# EAGLE design LMD18200_2_7_5 (EAGLE 7.7.0)
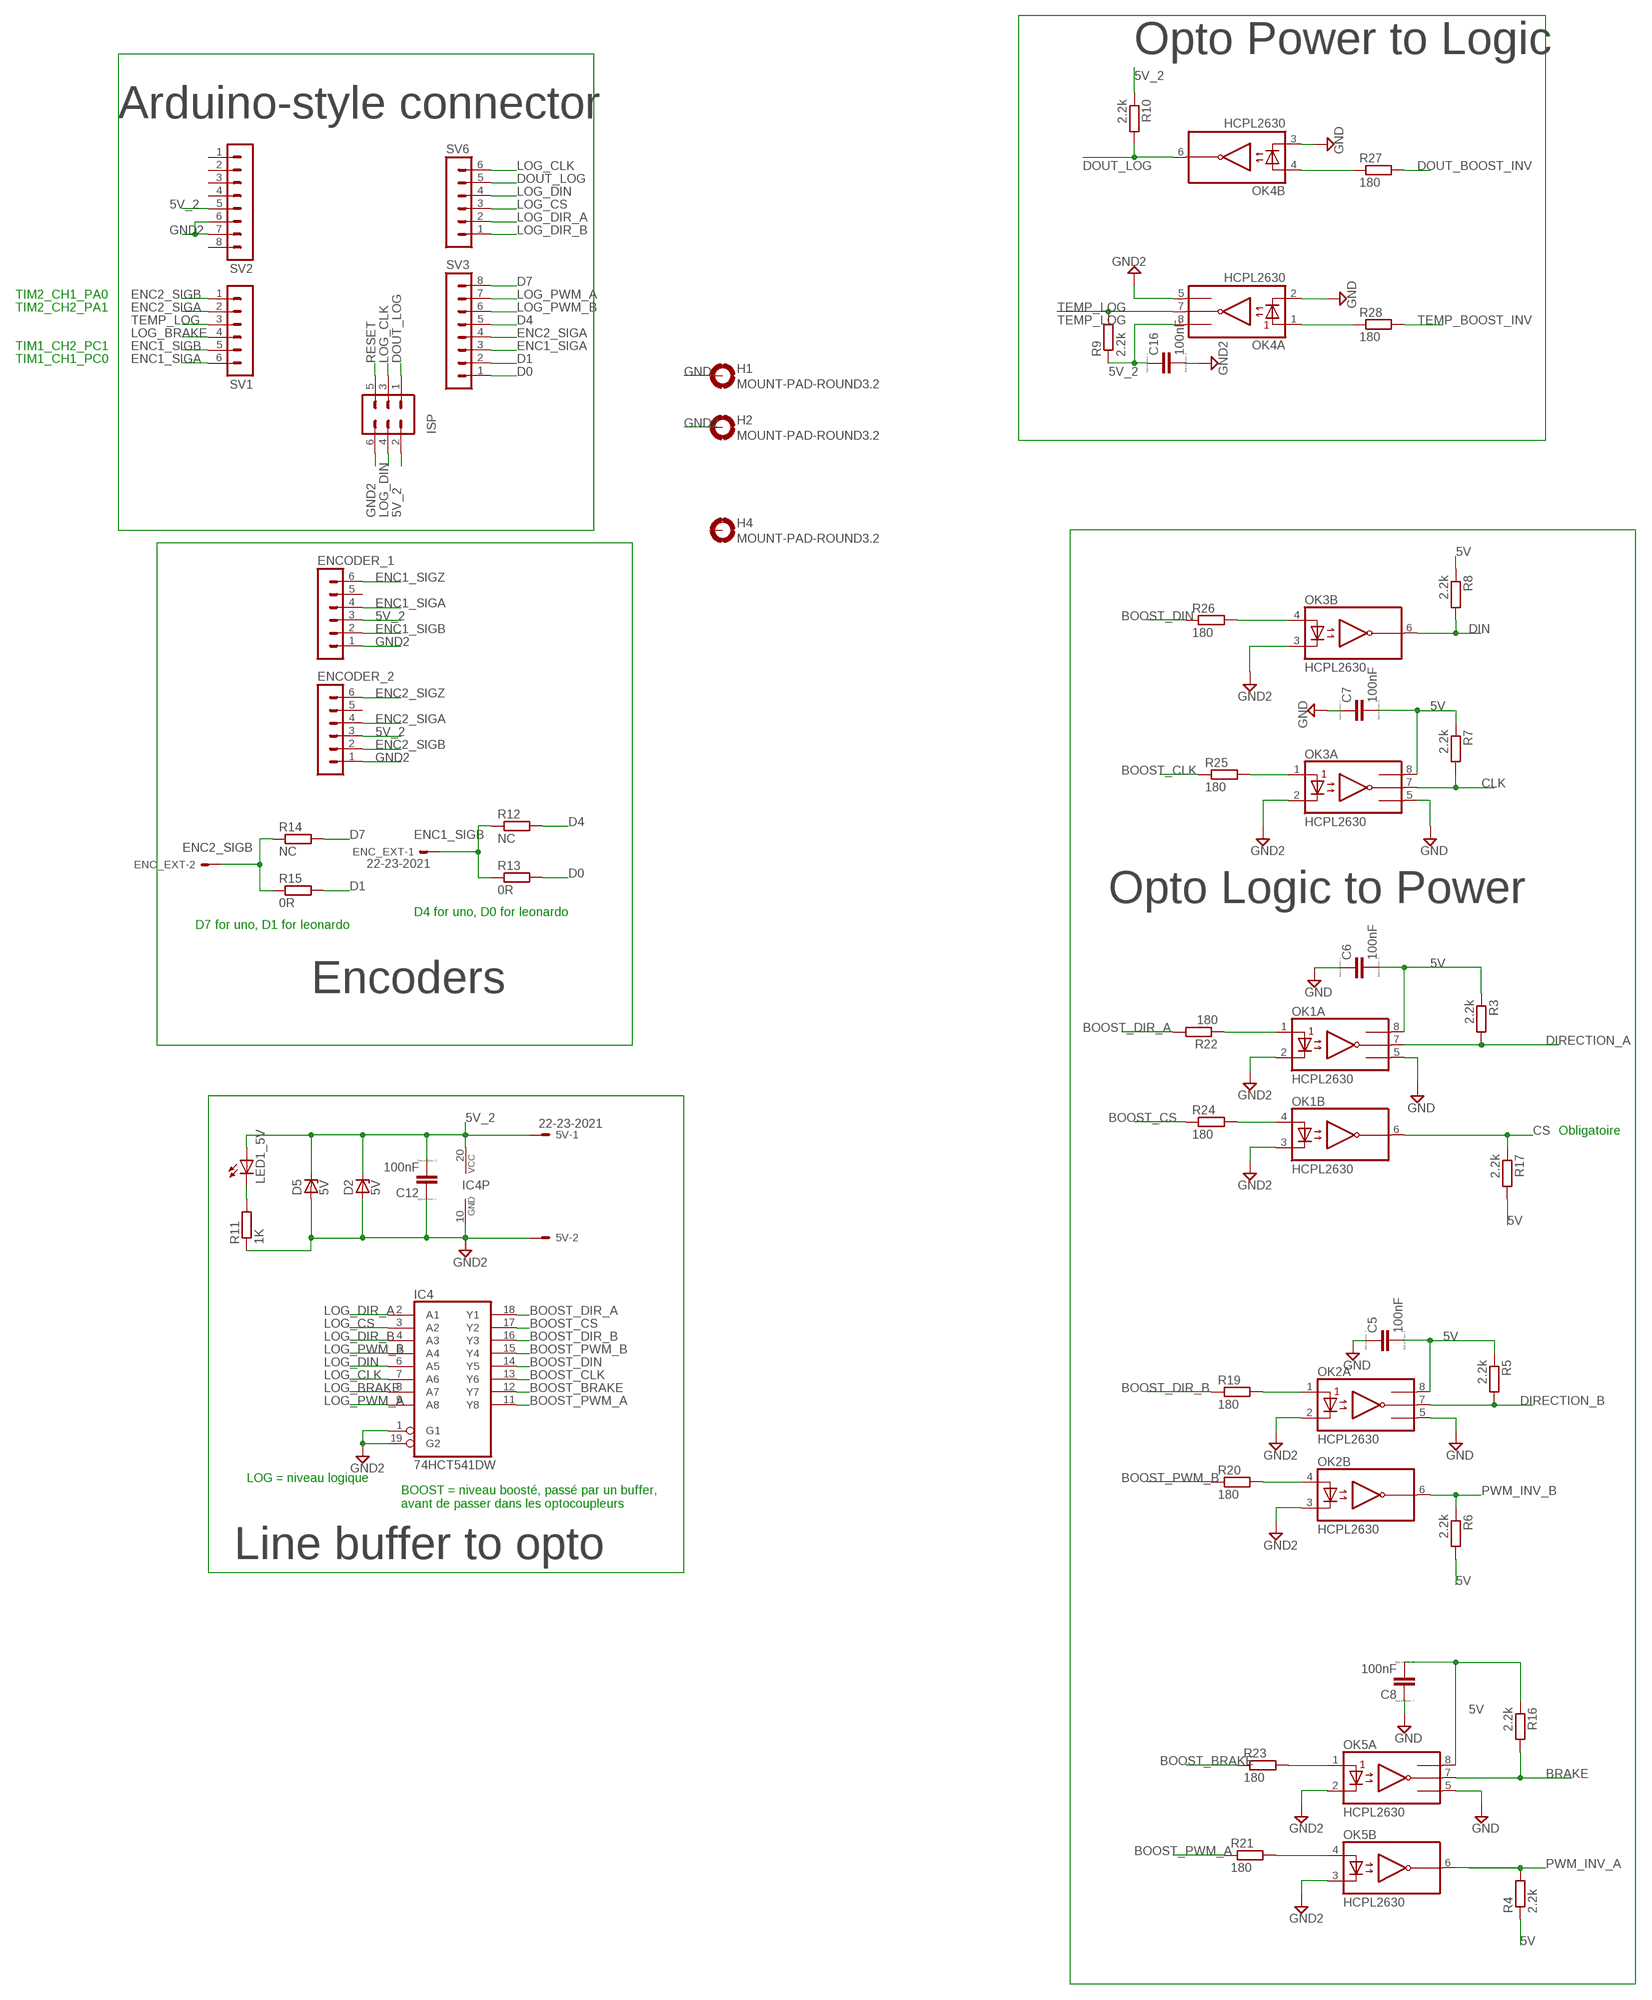
[diagram p0: schematic, sheet 1, part 1 of 2]
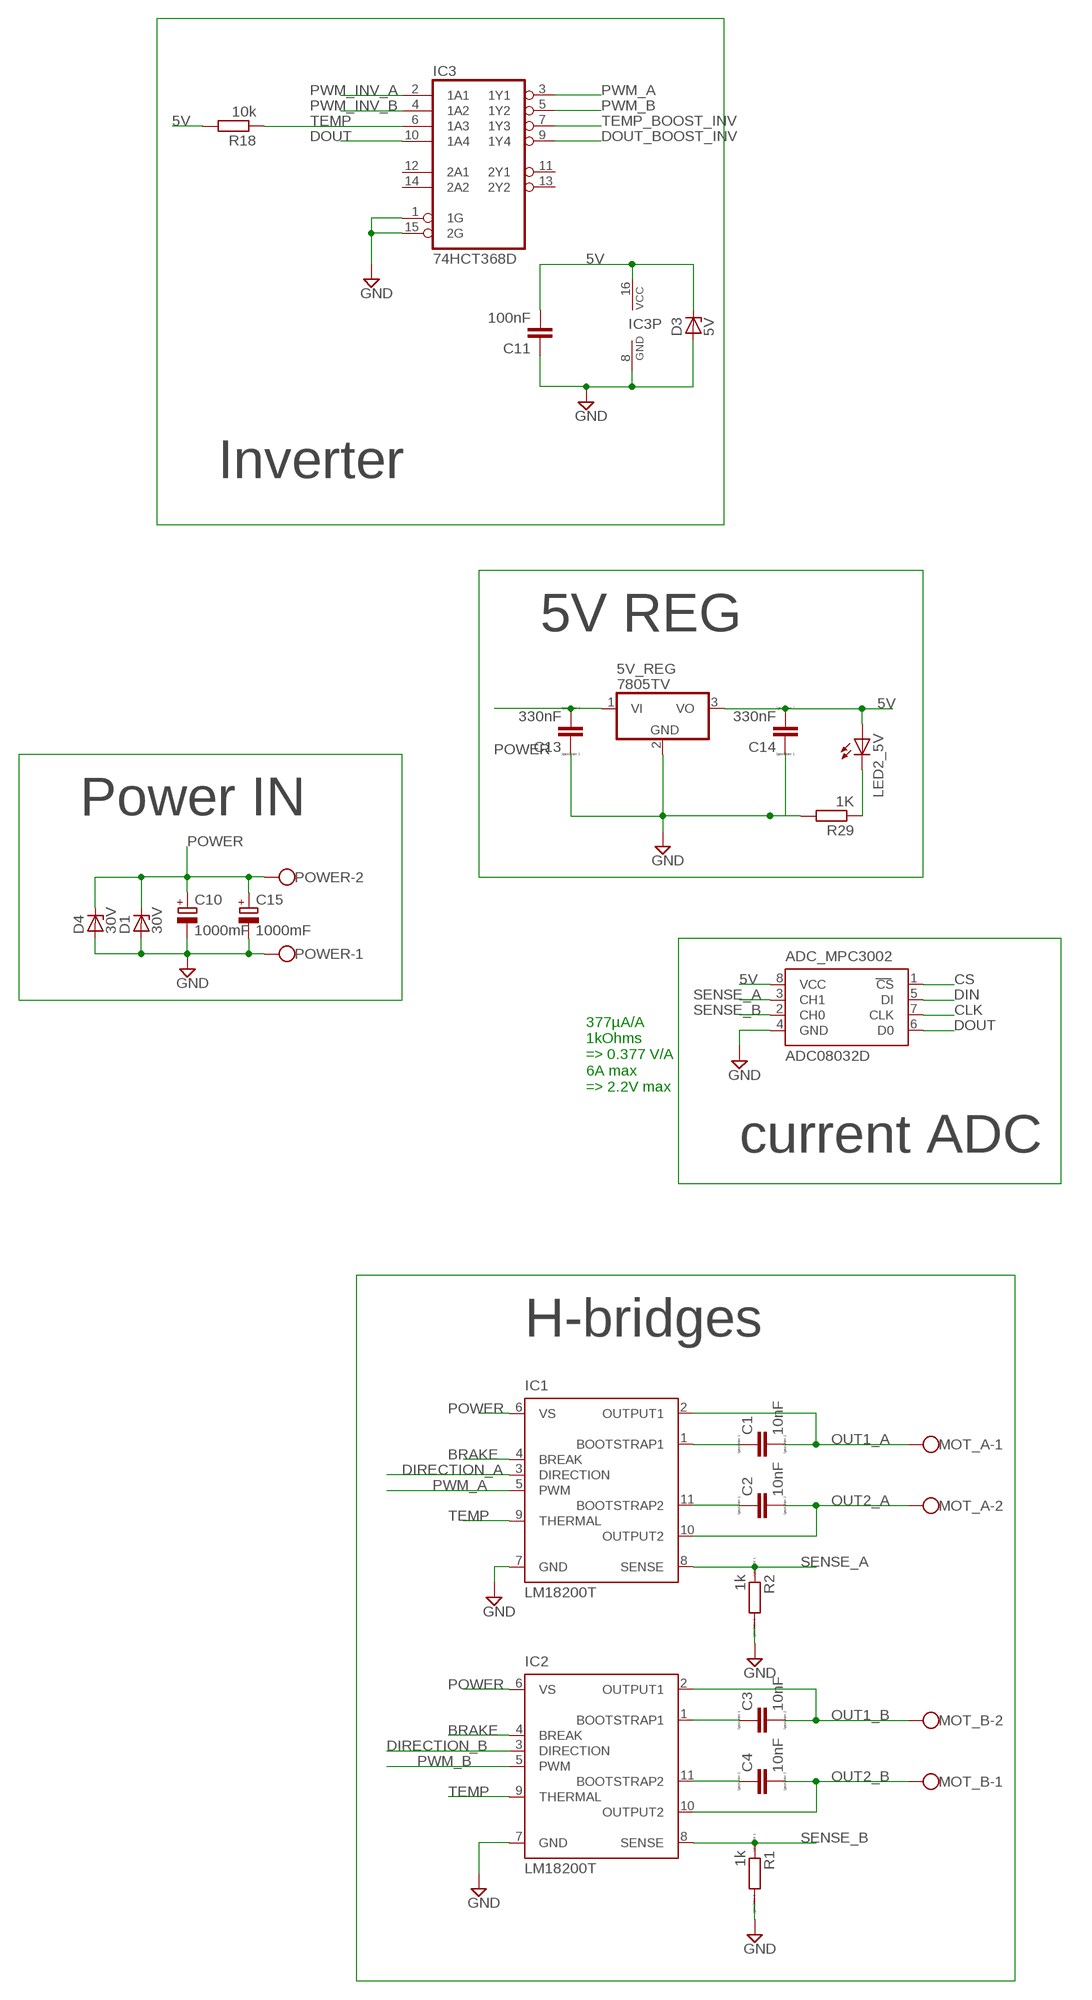
[diagram p1: schematic, sheet 1, part 2 of 2]

## Parts
5V  22-23-2021  [22-23-2021]
5V_REG  7805TV  [TO220V]
ADC_MPC3002  ADC08032D  [SO08]
C1  10nF  CC0603  [C0603]
C2  10nF  CC0603  [C0603]
C3  10nF  CC0603  [C0603]
C4  10nF  CC0603  [C0603]
C5  100nF  CC0603  [C0603]
C6  100nF  CC0603  [C0603]
C7  100nF  CC0603  [C0603]
C8  100nF  CC0603  [C0603]
C10  1000mF  CPOL-EUE5-13  [E5-13]
C11  100nF  C-EUC0805  [C0805]
C12  100nF  CC0603  [C0603]
C13  330nF  CC0603  [C0603]
C14  330nF  CC0603  [C0603]
C15  1000mF  CPOL-EUE5-13  [E5-13]
C16  100nF  CC0603  [C0603]
D1  30V  ZENER-DIODESOD80C  [SOD80C]
D2  5V  ZENER-DIODESOD80C  [SOD80C]
D3  5V  ZENER-DIODEDO34-7  [DO34Z7]
D4  30V  ZENER-DIODEDO34-7  [DO34Z7]
D5  5V  ZENER-DIODEDO34-7  [DO34Z7]
ENC_EXT  22-23-2021  [22-23-2021]
ENCODER_1  MA06-1  [MA06-1]
ENCODER_2  MA06-1  [MA06-1]
H1  MOUNT-PAD-ROUND3.2  [3,2-PAD]
H2  MOUNT-PAD-ROUND3.2  [3,2-PAD]
H4  MOUNT-PAD-ROUND3.2  [3,2-PAD]
IC1  LM18200T  [TO-220-11]
IC2  LM18200T  [TO-220-11]
IC3  74HCT368D  [SO16]
IC4  74HCT541DW  [SO20W]
ISP  MA03-2  [MA03-2]
LED1_5V  LEDSML0805  [SML0805]
LED2_5V  LEDSML0805  [SML0805]
MOT_A  W237-102  [W237-102]
MOT_B  W237-102  [W237-102]
OK1  HCPL2630  [DIL08]
OK2  HCPL2630  [DIL08]
OK3  HCPL2630  [DIL08]
OK4  HCPL2630  [DIL08]
OK5  HCPL2630  [DIL08]
POWER  W237-102  [W237-102]
R1  1k  RR0603  [R0603]
R2  1k  RR0603  [R0603]
R3  2.2k  R-EU_R0603  [R0603]
R4  2.2k  R-EU_R0603  [R0603]
R5  2.2k  R-EU_R0603  [R0603]
R6  2.2k  R-EU_R0603  [R0603]
R7  2.2k  R-EU_R0603  [R0603]
R8  2.2k  R-EU_R0603  [R0603]
R9  2.2k  R-EU_R0603  [R0603]
R10  2.2k  R-EU_R0603  [R0603]
R11  1K  R-EU_R0603  [R0603]
R12  NC  R-EU_R0603  [R0603]
R13  0R  R-EU_R0603  [R0603]
R14  NC  R-EU_R0603  [R0603]
R15  0R  R-EU_R0603  [R0603]
R16  2.2k  R-EU_R0603  [R0603]
R17  2.2k  R-EU_R0603  [R0603]
R18  10k  R-EU_R0603  [R0603]
R19  180  R-EU_R0603  [R0603]
R20  180  R-EU_R0603  [R0603]
R21  180  R-EU_R0603  [R0603]
R22  180  R-EU_R0603  [R0603]
R23  180  R-EU_R0603  [R0603]
R24  180  R-EU_R0603  [R0603]
R25  180  R-EU_R0603  [R0603]
R26  180  R-EU_R0603  [R0603]
R27  180  R-EU_R0603  [R0603]
R28  180  R-EU_R0603  [R0603]
R29  1K  R-EU_R0603  [R0603]
SV1  MA06-1  [MA06-1]
SV2  MA08-1  [MA08-1]
SV3  MA08-1  [MA08-1]
SV6  MA06-1  [MA06-1]

## Nets
5V: 5V_REG.3(VO) ADC_MPC3002.8(VCC) C5.2 C6.2 C7.2 C8.2 C11.2 C14.2 D3.C IC3.16(VCC) LED2_5V.A OK1.8(A:VCC) OK2.8(A:VCC) OK3.8(A:VCC) OK5.8(A:VCC) R3.1 R4.1 R5.1 R6.2 R7.1 R8.1 R16.1 R17.2 R18.2
5V_2: 5V.1 C12.2 C16.1 D2.C D5.C ENCODER_1.3 ENCODER_2.3 IC4.20(VCC) ISP.2 LED1_5V.A OK4.8(A:VCC) R9.1 R10.1 SV2.5
BOOST_BRAKE: IC4.12(Y7) R23.1
BOOST_CLK: IC4.13(Y6) R25.1
BOOST_CS: IC4.17(Y2) R24.1
BOOST_DIN: IC4.14(Y5) R26.1
BOOST_DIR_A: IC4.18(Y1) R22.2
BOOST_DIR_B: IC4.16(Y3) R19.1
BOOST_OUT1_A: C1.1 IC1.1(BOOTSTRAP1)
BOOST_OUT1_B: C3.1 IC2.1(BOOTSTRAP1)
BOOST_OUT2_A: C2.1 IC1.11(BOOTSTRAP2)
BOOST_OUT2_B: C4.1 IC2.11(BOOTSTRAP2)
BOOST_PWM_A: IC4.11(Y8) R21.1
BOOST_PWM_B: IC4.15(Y4) R20.1
BRAKE: IC1.4(BREAK) IC2.4(BREAK) OK5.7(A:VO1) R16.2
CLK: ADC_MPC3002.7(CLK) OK3.7(A:VO1) R7.2
CS: ADC_MPC3002.1(CS) OK1.6(B:VO2) R17.1
D0: R13.2 SV3.1
D1: R15.2 SV3.2
D4: R12.2 SV3.5
D7: R14.2 SV3.8
DIN: ADC_MPC3002.5(DI) OK3.6(B:VO2) R8.2
DIRECTION_A: IC1.3(DIRECTION) OK1.7(A:VO1) R3.2
DIRECTION_B: IC2.3(DIRECTION) OK2.7(A:VO1) R5.2
DOUT: ADC_MPC3002.6(D0) IC3.10(1A4)
DOUT_BOOST_INV: IC3.9(1Y4) R27.2
DOUT_LOG: ISP.1 OK4.6(B:VO2) R10.2 SV6.5
ENC1_SIGA: ENCODER_1.4 SV1.6 SV3.3
ENC1_SIGB: ENC_EXT.1 ENCODER_1.2 R12.1 R13.1 SV1.5
ENC1_SIGZ: ENCODER_1.6
ENC2_SIGA: ENCODER_2.4 SV1.2 SV3.4
ENC2_SIGB: ENC_EXT.2 ENCODER_2.2 R14.1 R15.1 SV1.1
ENC2_SIGZ: ENCODER_2.6
GND: 5V_REG.2(GND) ADC_MPC3002.4(GND) C5.1 C6.1 C7.1 C8.1 C10.- C11.1 C13.1 C14.1 C15.- D1.A D3.A D4.A H1.B3,2(MOUNT) IC1.7(GND) IC2.7(GND) IC3.1(1G) IC3.8(GND) IC3.15(2G) OK1.5(A:GND) OK2.5(A:GND) OK3.5(A:GND) OK4.2(A:C1) OK4.3(B:C2) OK5.5(A:GND) POWER.1 R1.2 R2.2 R29.2
GND2: 5V.2 C12.1 C16.2 D2.A D5.A ENCODER_1.1 ENCODER_2.1 H2.B3,2(MOUNT) IC4.1(G1) IC4.10(GND) IC4.19(G2) ISP.6 OK1.2(A:C1) OK1.3(B:C2) OK2.2(A:C1) OK2.3(B:C2) OK3.2(A:C1) OK3.3(B:C2) OK4.5(A:GND) OK5.2(A:C1) OK5.3(B:C2) R11.1 SV2.6 SV2.7
LED1_SIG: LED1_5V.C R11.2
LED2_5V_SIG: LED2_5V.C R29.1
LOG_BRAKE: IC4.8(A7) SV1.4
LOG_CLK: IC4.7(A6) ISP.3 SV6.6
LOG_CS: IC4.3(A2) SV6.3
LOG_DIN: IC4.6(A5) ISP.4 SV6.4
LOG_DIR_A: IC4.2(A1) SV6.2
LOG_DIR_B: IC4.4(A3) SV6.1
LOG_PWM_A: IC4.9(A8) SV3.7
LOG_PWM_B: IC4.5(A4) SV3.6
OUT1_A: C1.2 IC1.2(OUTPUT1) MOT_A.1
OUT1_B: C3.2 IC2.2(OUTPUT1) MOT_B.2
OUT2_A: C2.2 IC1.10(OUTPUT2) MOT_A.2
OUT2_B: C4.2 IC2.10(OUTPUT2) MOT_B.1
POWER: 5V_REG.1(VI) C10.+ C13.2 C15.+ D1.C D4.C IC1.6(VS) IC2.6(VS) POWER.2
PWM_A: IC1.5(PWM) IC3.3(1Y1)
PWM_B: IC2.5(PWM) IC3.5(1Y2)
PWM_INV_A: IC3.2(1A1) OK5.6(B:VO2) R4.2
PWM_INV_B: IC3.4(1A2) OK2.6(B:VO2) R6.1
R_BOOST_BRAKE: OK5.1(A:A1) R23.2
R_BOOST_CLK: OK3.1(A:A1) R25.2
R_BOOST_CS: OK1.4(B:A2) R24.2
R_BOOST_DIN: OK3.4(B:A2) R26.2
R_BOOST_DIR_A: OK1.1(A:A1) R22.1
R_BOOST_DIR_B: OK2.1(A:A1) R19.2
R_BOOST_PWM_A: OK5.4(B:A2) R21.2
R_BOOST_PWM_B: OK2.4(B:A2) R20.2
R_DOUT_BOOST_INV: OK4.4(B:A2) R27.1
R_TEMP_BOOST_INV: OK4.1(A:A1) R28.1
RESET: ISP.5
SENSE_A: ADC_MPC3002.3(CH1) IC1.8(SENSE) R2.1
SENSE_B: ADC_MPC3002.2(CH0) IC2.8(SENSE) R1.1
TEMP: IC1.9(THERMAL) IC2.9(THERMAL) IC3.6(1A3) R18.1
TEMP_BOOST_INV: IC3.7(1Y3) R28.2
TEMP_LOG: OK4.7(A:VO1) R9.2 SV1.3
Unconnected: ENCODER_1.5 ENCODER_2.5 H4.B3,2(MOUNT) IC3.11(2Y1) IC3.12(2A1) IC3.13(2Y2) IC3.14(2A2) SV2.1 SV2.2 SV2.3 SV2.4 SV2.8

## Notes on the sheet
- Opto Power to Logic
- Arduino-style connector
- TIM2_CH1_PA0
- TIM2_CH2_PA1
- TIM1_CH2_PC1
- TIM1_CH1_PC0
- Inverter
- 5V REG
- Power IN
- Opto Logic to Power
- D4 for uno, D0 for leonardo
- D7 for uno, D1 for leonardo
- Encoders
- 377µA/A
  1kOhms
  => 0.377 V/A
  6A max
  => 2.2V max
- current ADC
- Obligatoire
- H-bridges
- LOG = niveau logique
- BOOST = niveau boosté, passé par un buffer, 
  avant de passer dans les optocoupleurs
- Line buffer to opto

## Library data of the parts
5V ENC_EXT = con-molex:22-23-2021: .100" (2.54mm) Center Header - 2 Pin; MF: MOLEX; MPN: 22-23-2021; OC_FARNELL: 1462926; OC_NEWARK: 25C3832
5V_REG = linear:78*: Positive VOLTAGE REGULATOR Source: http://cache.national.com/ds/LM/LM78L05.pdf http://www.fairchildsemi.com/ds/LM/LM7805.pdf
ADC_MPC3002 = linear:ADC08032: A/D CONVERTER
C1-C8 C12-C14 C16 = eagle-ltspice:C: CAPACITOR, European symbol; SPICEMODEL: NONE; SPICEPREFIX: C
C10 C15 = resistor:CPOL-EU: POLARIZED CAPACITOR, European symbol
C11 = resistor:C-EU: CAPACITOR, European symbol
D1-D5 = diode:ZENER-DIODE: Z-Diode
ENCODER_1 ENCODER_2 SV1 SV6 = con-lstb:MA06-1: PIN HEADER; OC_FARNELL: unknown; OC_NEWARK: unknown
H1 H2 H4 = holes:MOUNT-PAD-ROUND: MOUNTING PAD, round
IC1 IC2 = national-semiconductor:LM18200T: 3A, 55V H-Bridge Motor Control SourcE: http://cache.national.com/ds/LM/LMD18200.pdf; OC_FARNELL: unknown; OC_NEWARK: unknown
IC3 = 74xx-eu:74*368: Hex BUS DRIVER, 3-state
IC4 = 74xx-eu:74*541: Octal BUFFER and LINE DRIVER, 3-state
ISP = con-lstb:MA03-2: PIN HEADER; OC_FARNELL: unknown; OC_NEWARK: unknown
LED1_5V LED2_5V = led:LED: LED OSRAM: - CHIPLED LG R971, LG N971, LY N971, LG Q971, LY Q971, LO R971, LY R971 LH N974, LH R974 LS Q976, LO Q976, LY Q976 LO Q996 - Hyper CHIPLED LW Q18S LB Q993, LB Q99A, LB R99A - SideLED LS A670, LO A670, LY A670, LG A670, LP A670 LB A673, LV A673, LT A673, LW A673 LH A674 LY A675 LS A676, LA A676, LO A676, LY A676, LW A676 LS A679, LY A679, LG A679 - Hyper Micro SIDELED® LS Y876, LA Y876, LO Y876, LY Y876 LT Y87S - SmartLED LW L88C, LW L88S LB L89C, LB L89S, LG L890 LS L89K, LO L89K, LY L89K LS L896, LA L896, LO L896, LY L896 - TOPLED LS T670, LO T670, LY T670, LG T670, LP T670 LSG T670, LSP T670, LSY T670, LOP T670, LYG T670 LG T671, LOG T671, LSG T671 LB T673, LV T673, LT T673, LW T673 LH T674 LS T676, LA T676, LO T676, LY T676, LB T676, LH T676, LSB T676, LW T676 LB T67C, LV T67C, LT T67C, LS T67K, LO T67K, LY T67K, LW E67C LS E67B, LA E67B, LO E67B, LY E67B, LB E67C, LV E67C, LT E67C LW T67C LS T679, LY T679, LG T679 LS T770, LO T770, LY T770, LG T770, LP T770 LB T773, LV T773, LT T773, LW T773 LH T774 LS E675, LA E675, LY E675, LS T675 LS T776, LA T776, LO T776, LY T776, LB T776 LHGB T686 LT T68C, LB T68C - Hyper Mini TOPLED® LB M676 - Mini TOPLED Santana® LG M470 LS M47K, LO M47K, LY M47K Source: http://www.osram.convergy.de LUXEON: - LUMILED® LXK2-PW12-R00, LXK2-PW12-S00, LXK2-PW14-U00, LXK2-PW14-V00 LXK2-PM12-R00, LXK2-PM12-S00, LXK2-PM14-U00 LXK2-PE12-Q00, LXK2-PE12-R00, LXK2-PE12-S00, LXK2-PE14-T00, LXK2-PE14-U00 LXK2-PB12-K00, LXK2-PB12-L00, LXK2-PB12-M00, LXK2-PB14-N00, LXK2-PB14-P00, LXK2-PB14-Q00 LXK2-PR12-L00, LXK2-PR12-M00, LXK2-PR14-Q00, LXK2-PR14-R00 LXK2-PD12-Q00, LXK2-PD12-R00, LXK2-PD12-S00 LXK2-PH12-R00, LXK2-PH12-S00 LXK2-PL12-P00, LXK2-PL12-Q00, LXK2-PL12-R00 Source: www.luxeon.com KINGBRIGHT: KA-3528ASYC Source: www.kingbright.com
MOT_A MOT_B POWER = con-wago-500:W237-102: WAGO SCREW CLAMP; MPN: 237-102; OC_FARNELL: unknown; OC_NEWARK: 70K9898
OK1-OK5 = optocoupler:HCPL2630: HEWLETT PACKARD OPTO COUPLER; MF: AGILENT TECHNOLOGIES; MPN: HCPL-2630-000E; OC_FARNELL: 9994904; OC_NEWARK: 88H7813
R1 R2 = eagle-ltspice:R: RESISTOR, European symbol; SPICEMODEL: NONE; SPICEPREFIX: R
R3-R29 = rcl:R-EU_: RESISTOR, European symbol
SV2 SV3 = con-lstb:MA08-1: PIN HEADER; OC_FARNELL: unknown; OC_NEWARK: unknown

## Board
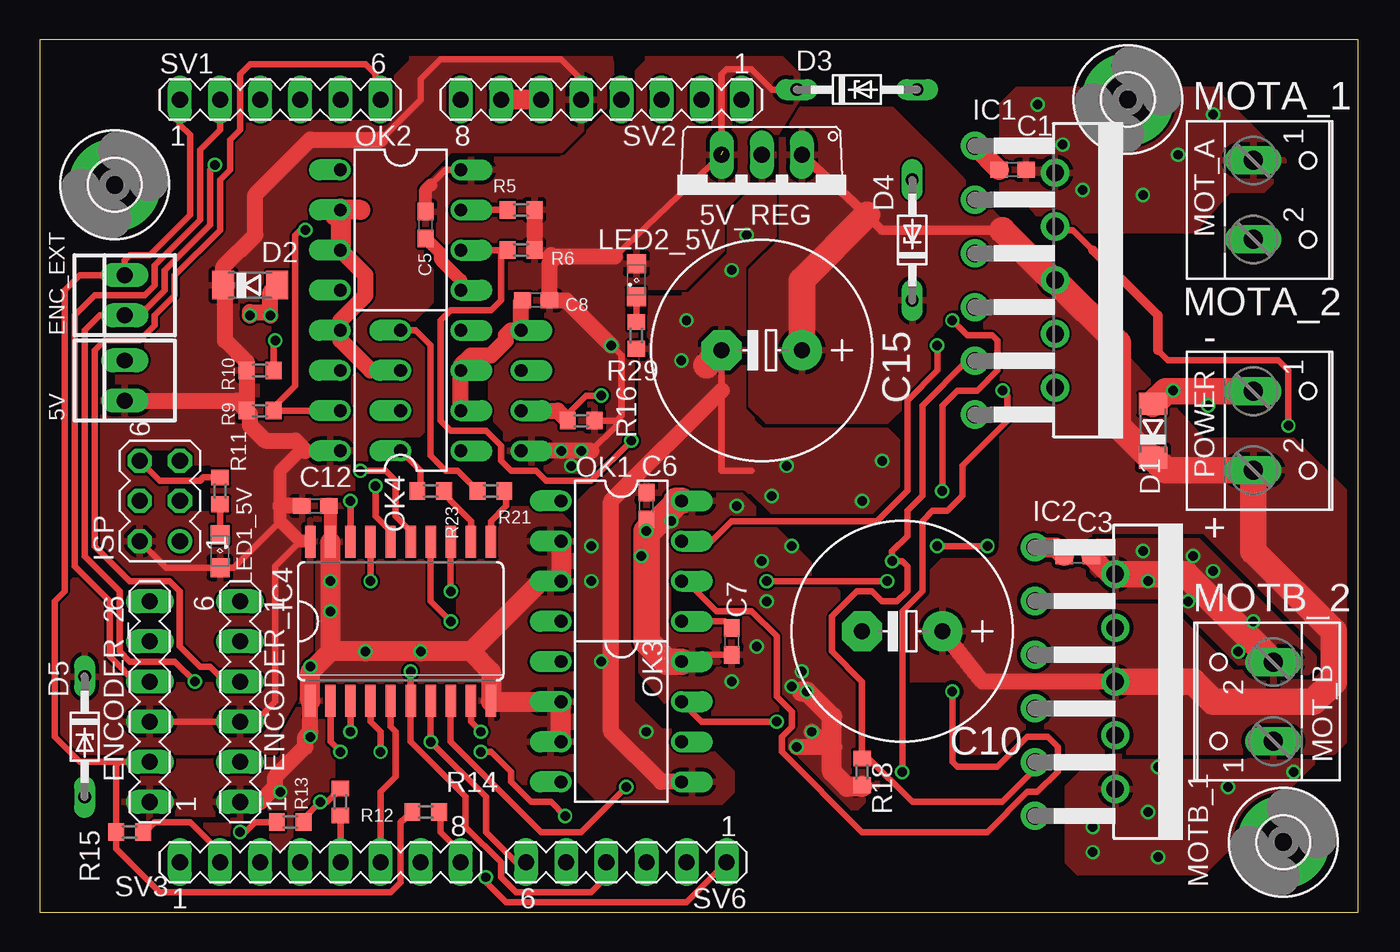
[diagram p2: board, top side]
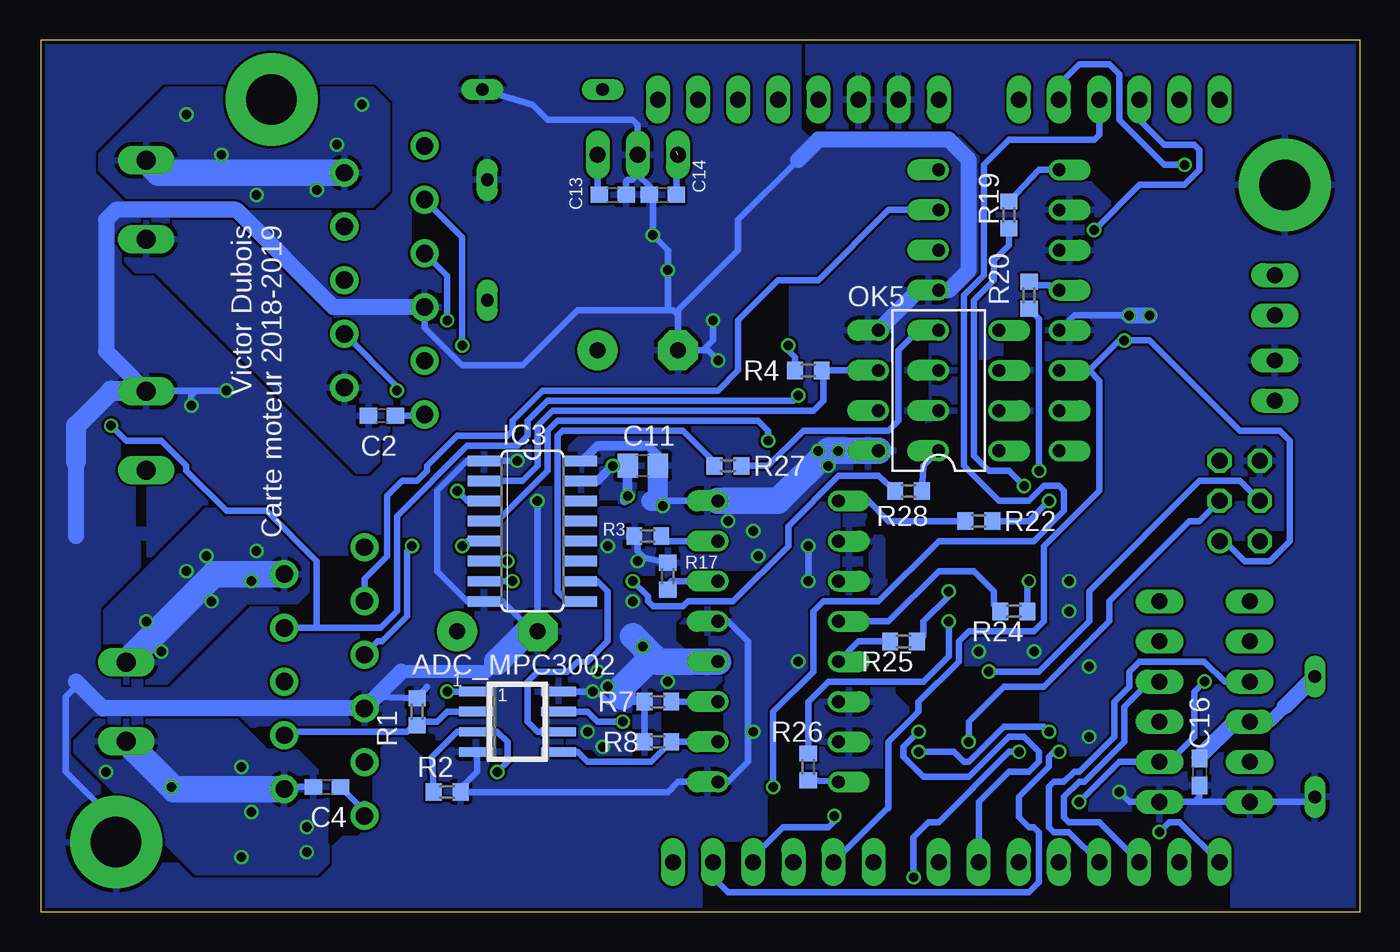
[diagram p3: board, bottom side, seen from below]

Size 83.49 x 55.23 mm. Coordinates in mm from the lower left corner, seen from the top.
Outline: 0,0 83.49,0 83.49,55.23 0,55.23 0,0
Copper layers (1*16): Top 0.035mm / dielectric 1.5mm / Bottom 0.035mm
Design rules "SeeedStudio_2layer_DRU_no_angle_20140221": minimum track width 6mil, minimum drill 12mil, track to track 6mil, track to pad 6mil, pad to pad 6mil, via to via 6mil, smd to smd 0mil, copper to edge 10mil, drill to drill 10mil, minimum pad ring 10mil, minimum via ring 6mil, stop-mask expansion 2mil, vias tented up to drill 100mil, thermal gap 10mil
tRestrict: area 23.2,36.8 to 25.1,38.4; area 23.2,29.2 to 24.8,30.5; area 20,26.4 to 20.3,27.3; area 10.2,14.6 to 11.1,14.9; area 8.3,14.6 to 9.2,14.9; area 4.4,32.7 to 4.8,34.3; area 19.1,32.1 to 19.7,34; area 48.9,21.3 to 49.2,22.5; area 45.4,25.1 to 45.7,25.7; area 40,18.7 to 40.3,20.6; area 14,32.1 to 14.3,33.7; area 14.3,50.2 to 21,50.5; 13 more areas
bRestrict: area 44.5,26 to 45.1,28.9; area 20.6,21.3 to 21.3,23.2; area 5.7,10.2 to 6,11.4; area 21.9,29.5 to 22.5,36.2; area 28.3,13 to 29.2,14.3; area 30.2,8.3 to 31.4,8.9; area 29.5,21 to 31.1,25.1; area 26.4,30.2 to 27.3,30.8; area 15.2,45.1 to 17.1,46.7; area 19.1,48.9 to 19.7,50.5; area 8.3,-0.3 to 8.9,2.2; area 38.4,-0.3 to 41.6,4.4; 32 more areas

### Footprints (pad centres in the part's own frame; a part is rotated, then mirrored left to right if it is on the bottom)
22-23-2021 = drill 1 long: 1 -1.27,0; 2 1.27,0
TO220V = drill 1.016 long: 1 -2.54,-2.54; 2 0,-2.54; 3 2.54,-2.54
SO08 = smd 0.6 x 2.2: 1 -1.905,-2.6; 2 -0.635,-2.6; 3 0.635,-2.6; 4 1.905,-2.6; 5 1.905,2.6; 6 0.635,2.6; 7 -0.635,2.6; 8 -1.905,2.6
C0603 = smd 1.1 x 1: 1 -0.85,0; 2 0.85,0
E5-13 = drill 1.016 pad 2.54: + -2.54,0 | drill 1.016 pad 2.54 octagon: - 2.54,0
C0805 = smd 1.3 x 1.5: 1 -0.95,0; 2 0.95,0
SOD80C = smd 1.4 x 1.8: A 1.7,0; C -1.7,0
DO34Z7 = drill 0.813 long: A 3.81,0; C -3.81,0
MA06-1 = drill 1.016 long: 1 -6.35,0; 2 -3.81,0; 3 -1.27,0; 4 1.27,0; 5 3.81,0; 6 6.35,0
3,2-PAD = drill 3.2 pad 5.842: B3,2 0,0
TO-220-11 = drill 1.1 pad 1.778: 1 -8.5,-9.37; 2 -6.8,-4.29; 3 -5.1,-9.37; 4 -3.4,-4.29; 5 -1.7,-9.37; 6 0,-4.29; 7 1.7,-9.37; 8 3.4,-4.29; 9 5.1,-9.37; 10 6.8,-4.29; 11 8.5,-9.37
SO16 = smd 0.66 x 2.032: 1 -4.445,-3.073; 2 -3.175,-3.073; 3 -1.905,-3.073; 4 -0.635,-3.073; 5 0.635,-3.073; 6 1.905,-3.073; 7 3.175,-3.073; 8 4.445,-3.073; 9 4.445,3.073; 10 3.175,3.073; 11 1.905,3.073; 12 0.635,3.073; 13 -0.635,3.073; 14 -1.905,3.073; 15 -3.175,3.073; 16 -4.445,3.073
SO20W = smd 0.66 x 2.032: 1 -5.715,-5.029; 2 -4.445,-5.029; 3 -3.175,-5.029; 4 -1.905,-5.029; 5 -0.635,-5.029; 6 0.635,-5.029; 7 1.905,-5.029; 8 3.175,-5.029; 9 4.445,-5.029; 10 5.715,-5.029; 11 5.715,5.029; 12 4.445,5.029; 13 3.175,5.029; 14 1.905,5.029; 15 0.635,5.029; 16 -0.635,5.029; 17 -1.905,5.029; 18 -3.175,5.029; 19 -4.445,5.029; 20 -5.715,5.029
MA03-2 = drill 1.016: 1 -2.54,-1.27 | drill 1.016 octagon: 2 -2.54,1.27; 3 0,-1.27; 4 0,1.27; 5 2.54,-1.27; 6 2.54,1.27
SML0805 = smd 1.2 x 1.2: A 1.05,0; C -1.05,0
W237-102 = drill 1.194 long: 1 -2.5,-1.27; 2 2.5,-1.27
DIL08 = drill 0.813 offset: 1 -3.81,-3.81; 2 -1.27,-3.81; 3 1.27,-3.81; 4 3.81,-3.81; 5 3.81,3.81; 6 1.27,3.81; 7 -1.27,3.81; 8 -3.81,3.81
R0603 = smd 1 x 1.1: 1 -0.85,0; 2 0.85,0
MA08-1 = drill 1.016 long: 1 -8.89,0; 2 -6.35,0; 3 -3.81,0; 4 -1.27,0; 5 1.27,0; 6 3.81,0; 7 6.35,0; 8 8.89,0

### Placement (x,y rotation side)
5V  5.4,33.66 90 top
5V_REG  45.72,45.4 180 top
ADC_MPC3002  53.34,12.06 270 bottom
C1  61.59,46.99 0 top
C2  61.91,31.43 180 bottom
C3  65.72,22.54 0 top
C4  65.41,7.94 180 bottom
C5  24.45,43.5 90 top
C6  38.42,25.72 270 top
C7  43.81,17.15 270 top
C8  31.43,38.73 0 top
C10  54.61,17.78 180 top
C11  45.4,28.26 0 bottom
C12  17.46,25.72 180 top
C13  47.31,45.4 180 bottom
C14  44.13,45.4 0 bottom
C15  45.72,35.56 180 top
C16  10.16,8.89 270 bottom
D1  70.48,30.48 90 top
D2  13.34,39.69 0 top
D3  51.75,52.07 0 top
D4  55.24,42.54 90 top
D5  2.86,11.11 270 top
ENC_EXT  5.4,39.05 90 top
ENCODER_1  12.7,13.33 90 top
ENCODER_2  6.99,13.33 90 top
H1  78.74,4.45 0 top
H2  4.76,46.04 0 top
H4  68.9,51.43 0 top
IC1  68.58,40 270 top
IC2  72.39,14.61 270 top
IC3  52.39,24.13 270 bottom
IC4  22.86,18.42 0 top
ISP  7.62,26.04 90 top
LED1_5V  11.43,22.86 270 top
LED2_5V  37.78,40 90 top
MOT_A  78.11,45.09 270 top
MOT_B  76.83,13.33 90 top
OK1  36.83,22.23 270 top
OK2  22.86,43.18 270 top
OK3  36.83,12.06 270 top
OK4  22.86,33.02 90 top
OK5  26.67,33.02 90 bottom
POWER  78.11,30.48 270 top
R1  59.69,12.7 90 bottom
R2  57.78,7.62 0 bottom
R3  45.09,23.81 0 bottom
R4  34.92,34.29 0 bottom
R5  30.48,44.45 180 top
R6  30.48,41.91 0 top
R7  44.45,13.33 0 bottom
R8  44.45,10.79 0 bottom
R9  13.97,31.75 0 top
R10  13.97,34.29 0 top
R11  11.43,26.67 270 top
R12  19.05,6.98 270 top
R13  15.88,5.71 180 top
R14  24.45,6.35 0 top
R15  5.71,5.08 0 top
R16  34.29,31.12 180 top
R17  43.81,21.27 90 bottom
R18  52.07,8.89 270 top
R19  22.23,44.13 90 bottom
R20  20.95,39.05 90 bottom
R21  28.57,26.67 180 top
R22  24.13,24.77 0 bottom
R23  24.77,26.67 180 top
R24  21.91,19.05 180 bottom
R25  28.89,17.15 180 bottom
R26  34.92,9.21 270 bottom
R27  40.01,28.26 180 bottom
R28  28.57,26.67 180 bottom
R29  37.78,36.51 270 top
SV1  15.24,51.43 0 top
SV2  35.56,51.43 180 top
SV3  17.78,3.17 0 top
SV6  37.15,3.17 180 top

### Tracks (layer width: path | path; a pad name or v marks a point on that pad's centre or on a via)
5V  (via drill 0.6)  (1 unrouted)
  Top 0.406: C7.2 41.06,16.3 OK3.8 | 24.77,46.04 25.72,46.99 OK2.8 | OK1.8 39.59,26.04 C6.2 | 32.38,41.59 31.65,41.59 R6.2 | 34.92,29.21 36.51,30.8 36.51,31.12 | 36.41,41.49 5V_REG.3 43.18,53.02 43.5,53.34 45.09,53.34 46.35,52.07 D3.C | R16.1 36.51,31.12 | 36.51,31.12 36.83,31.43 36.83,35.24 v36.2,35.88
  Top 0.813: C5.2 24.45,45.72 24.77,46.04
  Top 1.016: R5.1 R6.2 | 34.92,29.21 v34.29,29.21 v33.02,29.21 OK5.8 | v47.94,10.48 49.85,10.48 | 50.16,10.48 49.85,10.48 | 49.85,10.48 v48.9,11.43 | 36.41,41.49 32.7,41.49 | 32.7,41.49 32.49,41.49 32.38,41.59 | 32.7,41.49 32.28,41.07 C8.2 33.34,38.73 v36.2,35.88
  Top 1.27: R18.2 52.07,7.94 51.12,7.94 50.16,8.89 50.16,10.48 50.16,12.38 v48.58,13.97 48.26,13.97
  Top 1.422: v38.42,24.13 38.73,24.13 OK1.8
  Top 1.676: OK1.8 40.32,26.04 | v38.42,24.13 38.42,17.15 39.69,15.88 OK3.8
  Bottom 0.406: R8.1 R7.1 | R7.1 46.67,13.65 | R7.1 47.62,13.33 48.26,13.97 v48.58,13.97 ADC_MPC3002.8 | 44.87,26.04 OK1.8 | 48.9,28.58 IC3.16 | R4.1 35.77,35.14 36.35,35.72 v36.2,35.88 | R17.2 45.3,22.44 45.72,22.86 45.72,23.6 R3.1 | 43.28,48.16 C14.2
  Bottom 0.61: C11.2 44.45,28.89 45.09,29.53 48.26,29.53 49.21,28.58 IC3.16
  Bottom 1.27: 44.87,26.04 44.45,26.04 C11.2
  Bottom 1.676: OK5.8 v33.02,29.21 33.66,29.21 36.83,26.04 OK1.8 | 46.03,17.46 v45.4,16.83 44.77,16.19 | 44.77,16.19 44.45,15.88 OK3.8 | 46.67,13.65 46.67,14.29 44.77,16.19
  other vias: 40.01,24.77 38.1,22.54 33.66,28.26 48.26,15.24 47.62,14.29 43.81,14.61 46.04,19.69 44.13,25.72 47.62,23.18 45.72,22.23
  pour Top (rank 3): 24.45,46.04 26.04,47.62 33.02,47.62 36.2,50.8 36.2,53.98 46.99,53.98 47.94,53.02 47.94,51.43 44.45,45.72 43.18,44.45 43.18,41.91 37.47,36.2 37.47,30.48 34.92,27.94 29.53,27.94 29.53,30.48 28.57,31.43 28.57,35.24 29.84,36.51 29.84,41.91 25.4,41.91 24.45,42.86
  pour Bottom (rank 2): 29.53,28.89 29.53,29.85 31.11,31.43 47.94,31.43 50.48,28.89 49.21,28.89 49.21,25.72 47.94,24.45 48.26,21.59 47.31,20.64 47.31,17.15 49.53,14.92 51.75,14.92 52.07,14.61 52.07,12.7 49.85,10.48 48.58,10.48 47.94,9.84 45.4,9.84 44.45,10.79 44.45,13.65 43.81,14.29 40.96,14.29 40.01,15.24 40.01,15.88 40.64,16.51 42.86,16.51 43.5,17.15 43.5,18.42 42.23,19.69 40.01,19.69 33.66,24.77
  pour Top (rank 4): 47.62,10.48 43.81,10.48 39.69,13.33 38.1,15.24 38.1,24.45 40.01,26.35 44.45,26.35 50.48,20.32 50.48,15.56 51.44,14.92 51.44,9.84 53.02,8.26 53.02,7.94 51.75,6.67 51.44,6.67
5V_2
  Top 0.406: IC4.20 17.09,23.5 | OK4.8 17.14,29.21 17.09,29.16 | 13.02,32.07 R9.1 | SV2.5 34.29,52.7 33.02,53.98 25.4,53.98 24.13,52.7 24.13,51.43 21.59,48.89 | ISP.2 8.04,21.81 LED1_5V.A 12.29,21.81 15.24,24.77 | 16.51,23.5 14.92,21.91 14.92,13.33 13.65,12.06 ENCODER_1.3 ENCODER_2.3
  Top 0.813: 17.09,23.5 16.51,23.5 15.24,24.77 15.24,25.72 15.24,27.94 16.51,29.21 16.83,29.21 OK4.8
  Top 1.016: C12.2 15.24,25.72 | 16.83,29.21 16.19,29.85 14.29,29.85 13.34,30.8 13.34,31.54 R9.1 | 5V.1 12.48,32.38 R9.1 | R9.1 R10.1 13.12,34.82 11.75,36.2 11.75,39.57 D2.C 11.63,40.84 13.65,42.86 13.65,45.4 17.14,48.89 21.59,48.89
  Bottom 0.813: ENCODER_2.3 5.71,12.06 4.76,13.02
  Bottom 1.016: C16.1 10.16,9.84 7.94,12.06 ENCODER_2.3 | 4.76,13.02 D5.C
  pour Top: -0.64,53.98 36.2,53.98 36.2,51.43 33.02,48.26 26.04,48.26 24.13,46.35 24.13,41.27 24.77,40.64 24.77,23.5 17.14,23.5 17.14,16.51 16.19,15.56 16.19,13.65 14.92,11.43 14.92,10.16 -0.64,10.16
BOOST_BRAKE
  Top 0.406: IC4.12 27.3,24.77 26.03,26.04 R23.1
BOOST_CLK  (via drill 0.6)
  Top 0.406: v26.04,20.32 IC4.13
  Bottom 0.406: R25.1 27.62,17.46 27.62,18.42 26.04,20 v26.04,20.32
BOOST_CS  (via drill 0.6)
  Top 0.406: v20.95,20.96 IC4.17
  Bottom 0.406: R24.1 21.06,20.85 v20.95,20.96
BOOST_DIN  (via drill 0.6 pad 0.81)
  Top 0.406: IC4.14 24.77,19.69 v26.04,18.42
  Bottom 0.406: v26.04,18.42 26.04,16.19 27.62,14.61 33.66,14.61 34.92,13.33 R26.1
BOOST_DIR_A  (via drill 0.6)
  Top 0.406: v19.68,26.04 IC4.18
  Bottom 0.406: v19.68,26.04 20.95,24.77 R22.2
BOOST_DIR_B  (via drill 0.6)
  Top 0.406: IC4.16 22.23,24.13 21.27,25.08 v21.27,26.99
  Bottom 0.406: v21.27,26.99 22.23,27.94 23.5,27.94 24.45,28.89 24.45,38.73 23.18,40 23.18,41.27 22.23,42.23 R19.1
BOOST_OUT1_A
  Top 1.27: IC1.1 59.23,48.5 C1.1
BOOST_OUT1_B
  Top 1.27: IC2.1 64.31,23.11 C3.1
BOOST_OUT2_A
  Bottom 0.406: 59.28,31.43 C2.1
  Bottom 1.27: 59.28,31.43 IC1.11
BOOST_OUT2_B
  Bottom 0.406: 63.02,6.4 C4.1
  Bottom 1.27: IC2.11 63.02,6.4
BOOST_PWM_A
  Top 0.406: IC4.11 28.57,24.77 29.53,25.72 29.53,26.57 R21.1
BOOST_PWM_B  (via drill 0.6)
  Top 0.406: IC4.15 23.5,24.13 22.54,25.08 22.54,27.31 21.91,27.94 v20.32,27.94
  Bottom 0.406: v20.32,27.94 20.32,37.57 R20.1
BRAKE  (via drill 0.6)
  Top 0.406: 66.67,41.91 65.41,43.18 64.52,43.18 IC1.4 | v79.06,30.8 79.06,34.29 78.42,34.92 71.44,34.92 70.8,35.56 | R16.2 33.44,31.54 34.61,32.7 v35.56,32.7
  Top 0.61: 70.8,35.56 70.8,37.78 66.67,41.91
  Top 1.016: OK5.7 32.8,31.75 R16.2
  Bottom 0.406: 67.88,17.78 IC2.4 66.04,18.01 | 66.04,18.01 62.01,18.01 60.96,19.05 60.96,25.08 56.52,29.53 53.34,29.53 52.7,30.16 52.7,31.12 51.44,32.38 35.88,32.38 v35.56,32.7 | 66.04,18.01 66.04,22.23 69.22,25.4 71.75,25.4 74.3,27.94 74.3,28.26 75.88,29.85 78.11,29.85 v79.06,30.8
CLK  (via drill 0.6)
  Top 0.406: v46.67,12.06 41.91,12.06 OK3.7
  Bottom 0.406: OK3.7 R7.2 | ADC_MPC3002.7 48.9,12.7 48.26,12.06 v46.67,12.06
CS  (via drill 0.6)
  Top 0.406: v57.78,13.97 57.78,9.53 58.1,9.21 60.64,9.21 62.55,11.11 63.82,11.11 64.45,10.48 64.45,8.89 63.18,7.62 62.55,7.62 60.01,5.08 52.07,5.08 46.99,10.16 46.99,11.11 47.62,11.75 47.62,12.7 46.67,13.65 46.67,17.46 45.09,19.05 42.86,19.05 41.59,20.32 41.59,20.96 OK1.6
  Bottom 0.406: ADC_MPC3002.1 v57.78,13.97 | OK1.6 43.6,20.96 R17.1
D0  (via drill 0.6 pad 0.81)
  Top 0.406: v12.7,5.08 13.02,5.08 13.65,5.71 R13.2
  Bottom 0.406: SV3.1 11.43,5.71 12.06,5.71 v12.7,5.08
D1
  Top 0.406: SV3.2 11.43,3.81 9.53,5.71 7.3,5.71 R15.2
D4
  Top 0.406: SV3.5 R12.2
D7
  Top 0.406: SV3.8 26.67,3.81 25.4,5.08 25.4,6.35 R14.2
DIN
  Bottom 0.406: OK3.6 R8.2 44.87,9.53 48.9,9.53 49.53,10.16 ADC_MPC3002.5
DIRECTION_A  (via drill 0.6)
  Top 0.406: OK1.7 42.55,23.5 43.81,24.77 53.02,24.77 54.93,26.67 54.93,32.38 56.83,34.29 v56.83,35.88
  Bottom 0.406: OK1.7 43.92,23.5 R3.2 | v56.83,35.88 56.83,42.73 IC1.3
DIRECTION_B
  Top 0.406: OK2.7 R5.2
  Bottom 0.406: OK2.7 29.84,44.45 34.29,40 36.83,40 39.37,37.46 39.37,34.29 40.64,33.02 51.75,33.02 53.66,31.12 53.66,30.48 53.98,30.16 57.15,30.16 59.05,28.26 59.05,27.94 59.69,27.31 60.64,27.31 61.59,26.35 61.59,22.54 63.02,21.12 IC2.3 63,19.69 63,20.19
DOUT
  Bottom 0.406: ADC_MPC3002.6 52.07,11.43 52.7,12.06 52.7,14.61 52.07,15.24 50.16,15.24 49.53,15.88 48.9,15.88 47.62,17.15 47.62,20.32 48.26,20.96 IC3.10
DOUT_BOOST_INV
  Bottom 0.406: IC3.9 50.16,19.69 50.8,20.32 50.8,30.16 50.48,30.48 42.86,30.48 40.95,28.58 R27.2
DOUT_LOG  (via drill 0.6)
  Top 0.406: R10.2 14.82,36.09 v14.92,36.2
  Bottom 0.406: OK4.6 17.14,34.29 | 17.14,34.29 15.24,36.2 v14.92,36.2 13.34,36.2 7.62,30.48 5.08,30.48 4.45,29.85 4.45,23.5 5.71,22.23 7.3,22.23 8.57,23.5 ISP.1 | SV6.5 29.91,6.6 29.84,6.6 29.84,10.79 27.94,12.7 27.94,13.33 25.4,15.88 25.4,17.15 24.77,17.78 20.64,17.78 20,18.42 20,23.18 16.51,26.67 16.51,33.66 17.14,34.29
ENC1_SIGA
  Top 0.406: SV1.6 21.27,51.75 21.27,53.02 20.64,53.66 13.34,53.66 12.7,53.02 12.7,49.53 12.06,48.89 12.06,46.99 11.43,46.35 11.43,43.18 8.57,40.32 8.57,39.05 7.3,37.78 7.3,37.15 6.35,36.2 4.13,36.2 3.49,35.56 3.49,23.18 5.71,20.96 8.26,20.96 8.89,20.32 8.89,16.83 10.16,15.56 10.79,15.56 11.75,14.61 ENCODER_1.4 12.38,14.61
  Bottom 0.406: SV3.3 16.51,5.71 18.41,5.71 18.73,6.03 18.73,7.3 17.78,8.26 17.46,8.26 14.92,10.79 14.92,13.02 13.34,14.61 ENCODER_1.4
ENC1_SIGB  (via drill 0.6)
  Top 0.406: v11.11,47.31 10.79,46.99 10.79,43.5 7.94,40.64 7.94,39.37 6.67,38.1 5.71,38.1 ENC_EXT.1 3.81,37.78 2.86,36.83 2.86,22.54 5.08,20.32 5.08,16.51 5.71,15.88 8.57,15.88 v9.84,14.61 | R13.1 16.73,5.93 v17.78,6.98 18.2,6.98 R12.1
  Bottom 0.406: SV1.5 19.05,52.39 17.78,53.66 15.88,53.66 15.24,53.02 15.24,50.16 12.38,47.31 v11.11,47.31 | v9.84,14.61 10.48,13.97 10.48,11.11 12.06,9.53 ENCODER_1.2 15.24,9.53 v17.78,6.98
ENC2_SIGA
  Top 0.406: SV1.2 11.43,49.53 10.16,48.26 10.16,43.81 7.3,40.96 7.3,39.69 6.67,39.05 3.49,39.05 2.22,37.78 2.22,21.91 4.45,19.69 4.45,16.19 6.35,14.29 6.67,14.29 ENCODER_2.4
  Bottom 0.406: 16.51,1.91 SV3.4 18.41,5.08 19.37,5.08 19.68,5.4 19.68,7.94 19.37,8.26 18.73,8.26 18.1,8.89 17.78,8.89 15.56,11.11 15.56,13.33 14.61,14.29 14.61,15.24 13.97,15.88 9.84,15.88 8.57,14.61 ENCODER_2.4
ENC2_SIGB
  Top 0.406: R14.1 22.86,5.71 22.86,1.91 22.23,1.27 7.62,1.27 4.87,4.03 R15.1 4.87,9.31 5.08,9.53 | 6.35,9.53 ENCODER_2.2 5.08,9.53 | 5.08,9.53 2.54,9.53 0.95,11.11 0.95,19.69 1.59,20.32 1.59,39.37 2.54,40.32 ENC_EXT.2 5.4,41.27 5.71,41.59 6.99,41.59 9.53,44.13 9.53,49.21 8.89,49.85 SV1.1
GND  (via drill 0.6)
  Top 0.406: 45.09,27.94 43.18,27.94 43.18,33.02 C15.- | OK1.5 43.4,18.42 C7.1
  Top 0.813: OK2.5 26.67,40 25.4,41.27 25.4,41.7 C5.1
  Top 1.016: OK3.5 39.37,8.26 36.2,11.43 36.2,26.04 43.18,33.02 | OK4.2 OK4.3 26.67,34.61 27.3,35.24 28.57,35.24 29.53,36.2 29.53,36.51 29.84,36.83 OK5.5 30.48,38.63 C8.1
  Top 1.676: POWER.1 71.28,32.98 D1.A | C15.- 42.23,34.61
  Bottom 0.406: R2.2 56.84,7.93 55.88,8.89 55.88,10.1 ADC_MPC3002.4 | 62.27,13.65 R1.2 59.05,14.29 | OK1.5 40.01,18.42 38.73,17.15 38.73,9.53 40.01,8.26 OK3.5 43.18,8.26 43.82,7.62 56.83,7.62 | IC3.1 56.52,28.58 58.42,26.67 58.42,21.59 56.52,19.69 IC3.8 54.29,19.69 52.39,17.78 C10.- v52.07,26.04 | H1.B3,2 78.74,5.71 81.92,8.89 81.92,13.65 81.12,14.45 | 35.56,47.62 39.37,43.81 39.37,41.91 43.18,38.1 43.18,37.78 | 43.18,37.78 C15.- 41.59,35.56 | IC1.7 59.21,36.98 56.83,34.61 53.02,34.61 49.53,38.1 43.81,38.1 | 43.81,38.1 43.5,38.1 43.18,37.78 | v40.64,34.92 41.27,35.56 41.59,35.56 | v40.96,37.46 40.96,36.2 41.59,35.56 | 43.81,38.1 v43.81,40.64 43.81,41.91 v44.77,42.86 44.77,45.19 C14.1 44.98,45.93 45.72,46.67 | 45.72,46.67 5V_REG.2 45.72,49.85 46.04,50.16 51.44,50.16 52.39,51.12 D3.A | C13.1 46.46,46.25 46.35,46.35 46.04,46.35 45.72,46.67 | v34.92,20.96 v34.92,23.18 | C11.1 v47.31,28.26 | v71.75,33.02 73.66,33.02 | 73.66,33.02 76.8,33.02 POWER.1 | v73.98,32.07 73.98,32.7 73.66,33.02 | v53.34,28.58 54.93,28.58
  Bottom 0.61: 46.57,26.04 46.35,26.67 C11.1 | IC3.15 48.26,27.31 v47.31,28.26
  Bottom 0.813: 54.61,15.88 55.24,15.24 60.69,15.24 | 56.83,7.62 R2.2
  Bottom 1.016: 81.28,14.61 81.12,14.45 79.58,12.9 IC2.7 62.27,13.65 60.69,15.24 | 81.28,23.81 81.28,28.54 | IC1.7 64.97,38.3 71.12,44.45 78.74,44.45 79.38,43.81 79.38,35.52 POWER.1 | OK5.5 27.94,39.37 OK2.5 26.04,39.37 24.77,40.64 24.77,47.62 26.04,48.89 34.29,48.89 35.56,47.62
  Bottom 1.27: 81.28,28.54 81.28,30.8 79.06,33.02 76.88,33.02 POWER.1
  Bottom 1.676: C10.- 52.7,17.78 54.61,15.88
  other vias: 35.56,15.88 38.42,11.43 46.35,26.35
  pour Bottom (rank 5): 23.5,46.99 25.4,48.89 34.92,48.89 35.56,49.53 35.56,58.42 88.27,58.42 88.27,-4.45 35.88,-4.13 35.88,8.26 33.34,10.48 33.02,27.94 25.72,28.26 25.72,38.42 24.45,39.05 23.18,40 23.18,46.99
  pour Top (rank 5): 34.29,41.91 34.29,48.26 36.83,53.98 46.99,53.98 46.99,42.54 45.09,40.64 45.09,31.12 45.72,30.48 53.66,30.48 54.29,29.85 54.29,26.99 52.7,25.4 46.35,25.4 45.09,26.67 40.01,26.67 37.47,24.13 37.47,13.33 39.37,11.43 41.27,11.43 43.81,8.89 43.81,7.62 43.18,6.98 35.56,6.98 34.29,8.26 34.29,26.04 38.1,29.85 38.1,38.1
GND2  (via drill 0.6)
  Top 0.406: OK3.2 32.97,13.39 | R11.1 10.38,27.52 10.16,27.31 7.62,27.31 ISP.6
  Top 0.813: IC4.19 18.41,25.62 C12.1
  Top 1.016: 21.59,34.29 20.95,34.29 19.05,36.2 OK4.5 19.05,37.46 20.64,39.05 20.64,40.32 OK2.3 | v13.34,37.78 13.34,37.99 14.4,37.99 v14.61,37.78 14.61,39.26 D2.A | ENCODER_1.1 13.97,6.98 14.92,7.94 14.92,8.57 16.83,10.48 16.83,11.11 17.14,11.43 IC4.1
  Top 1.27: SV2.6 SV2.7 | 20.32,44.45 OK2.2 OK2.3 | 21.59,34.29 OK5.3 | OK3.3 33.02,13.02 32.7,13.33 28.57,13.33 | OK1.2 OK1.3 31.75,20.96 27.3,16.51 | 27.3,16.51 v24.13,16.51 v20.64,16.51 18.41,16.51 | 18.41,16.51 v18.41,19.05 v18.41,20.96 IC4.19 | 27.3,16.51 28.57,15.24 IC4.10 | IC4.1 17.14,15.24 18.41,16.51
  Top 1.422: 18.73,44.13 OK2.2
  Bottom 0.406: 10.48,6.98 ENCODER_2.1 3.17,6.98 D5.A | 10.48,6.98 ENCODER_1.1 14.61,6.98 v15.24,7.62 | v14.61,37.78 18.1,37.78 OK4.5 | 10.48,6.98 10.16,7.3 10.16,7.94
  Bottom 1.016: v14.61,37.78 v13.34,37.78
  other vias: 17.14,15.56 17.14,11.11
  pour Bottom (rank 6): -7.62,58.42 -7.62,-3.17 -4.45,0 34.92,0 34.92,26.67 33.66,27.94 25.4,27.94 25.08,29.21 25.08,38.42 22.86,40.32 22.86,46.35 25.4,48.89 34.92,48.89 34.92,57.78 34.29,58.42
  pour Top (rank 4): 5.08,9.53 14.29,9.53 14.92,10.16 14.92,11.43 16.19,13.65 16.19,25.08 17.78,26.67 31.43,26.67 33.66,24.45 33.66,5.71 32.07,4.13 6.03,4.13 5.08,5.08
LED1_SIG
  Top 0.406: R11.2 LED1_5V.C
LED2_5V_SIG
  Top 0.406: R29.1 LED2_5V.C
LOG_BRAKE  (via drill 0.6)
  Top 0.406: IC4.8 26.04,10.79 31.75,5.08 34.29,5.08 v37.15,7.94
  Bottom 0.406: v37.15,7.94 37.15,12.7 34.61,15.24 34.61,19.05 33.97,19.69 30.48,19.69 26.67,23.5 20.64,23.5 18.73,25.4 18.73,26.67 19.05,26.99 20,26.99 20.95,26.04 22.86,26.04 25.08,28.26 25.08,39.05 23.81,40.32 23.81,47.31 22.23,48.89 16.83,48.89 16.51,49.21 SV1.4
LOG_CLK  (via drill 0.6)
  Top 0.406: IC4.7 v24.77,10.79 28.26,7.3 28.26,5.08 30.16,3.17 SV6.6
  Bottom 0.406: v24.77,10.79 24.77,12.06 22.54,14.29 20,14.29 15.88,18.42 15.88,19.69 10.79,24.77 10.16,24.77 ISP.3
LOG_CS  (via drill 0.6)
  Top 0.406: v33.27,6.1 32.38,6.98 31.11,6.98 29.84,8.26 29.84,8.89 28.57,10.16 v27.94,10.16 | v19.68,11.43 IC4.3
  Bottom 0.406: v27.94,10.16 25.72,10.16 25.08,9.53 24.77,9.53 22.54,11.75 20,11.75 v19.68,11.43 | SV6.3 38.42,3.49 36.51,5.4 33.66,5.4 33.27,5.78 v33.27,6.1
LOG_DIN  (via drill 0.6 pad 0.81)
  Top 0.406: v23.5,15.24 IC4.6 23.5,10.79 26.99,7.3 26.99,5.4 29.21,3.17 29.21,2.22 30.16,1.27 34.92,1.27 35.88,2.22 SV6.4
  Bottom 0.406: v23.5,15.24 20.32,15.24 17.14,18.42 17.14,20.32 10.16,27.31 7.62,27.31 ISP.4
LOG_DIR_A  (via drill 0.6)
  Top 0.406: IC4.2 18.41,10.79 v19.05,10.16
  Bottom 0.406: SV6.2 40.96,2.22 40.01,1.27 20.95,1.27 20.32,1.91 20.32,5.08 20.64,5.4 20.95,5.4 21.59,6.03 21.59,7.3 19.68,9.21 19.68,9.84 19.37,10.16 v19.05,10.16
LOG_DIR_B  (via drill 0.6)
  Top 0.406: IC4.4 20.95,12.06 21.59,11.43 v21.59,10.16 | v28.26,2.22 28.26,1.91 29.53,0.64 40.96,0.64 SV6.1
  Bottom 0.406: v21.59,10.16 22.23,10.16 26.67,5.71 27.3,5.71 28.26,4.76 v28.26,2.22
LOG_PWM_A  (via drill 0.6)
  Top 0.406: IC4.9 27.3,12.06 v27.94,11.43
  Bottom 0.406: SV3.7 24.13,6.98 22.23,8.89 20.95,8.89 20.32,9.53 20.32,10.16 21.27,11.11 22.23,11.11 24.77,8.57 27.62,8.57 28.89,9.84 28.89,10.48 v27.94,11.43
LOG_PWM_B
  Top 0.406: IC4.5 22.23,11.75 22.54,11.43 22.54,8.57 21.59,7.62 SV3.6
OUT1_A  (via drill 0.6)
  Bottom 1.676: IC1.2 76.06,46.8 MOT_A.1
  other vias: 72.07,47.94 74.3,50.48 66.04,45.72 64.77,48.58 63.18,51.12 69.85,45.4
  pour Top: 61.91,45.72 64.14,43.18 73.03,43.18 75.25,45.72 77.47,45.72 78.74,46.99 78.74,47.62 74.3,52.07 61.91,52.07 60.96,51.12 60.96,45.72
  pour Bottom: 61.59,45.72 61.59,51.12 62.55,52.07 75.56,52.07 79.69,47.94 79.69,46.99 77.47,44.77 62.55,44.77
OUT1_B  (via drill 0.6)
  Top 1.27: IC2.2 67.71,21.41 C3.2
  Top 1.676: IC2.2 72.58,21.41 78.11,15.88
  Bottom 1.676: IC2.2 72.53,21.41 MOT_B.2
  other vias: 69.85,22.86 70.17,20.96 73.03,22.54 72.71,19.69 74.3,21.59 76.83,18.42 75.88,16.51
  pour Bottom: 66.67,20.32 66.67,22.23 69.85,25.4 73.03,25.4 78.74,19.69 79.38,19.05 79.38,15.24 78.74,14.61 75.56,14.61 70.48,19.69 67.31,19.69
  pour Top: 66.67,22.86 66.67,23.18 66.99,23.5 73.34,23.5 80.64,16.19 80.64,15.56 80.01,14.92 79.69,14.61 77.15,14.61 75.88,15.88 71.75,20 68.26,20 66.67,21.59
OUT2_A
  pour Bottom: 62.23,28.58 62.23,29.85 60.33,31.75 59.69,32.38 59.69,34.92 60.33,35.56 62.23,35.56 70.48,43.81 77.47,43.81 78.74,42.54 78.74,41.91 77.47,40.64 76.2,40.64 63.5,27.94 62.87,27.94
OUT2_B  (via drill 0.6)
  Bottom 0.406: C4.2 67.97,7.94
  Bottom 1.27: 67.97,7.94 IC2.10
  Bottom 1.676: IC2.10 75.08,7.8 MOT_B.1
  other vias: 66.67,5.4 66.67,3.81 70.8,3.49 70.17,6.35 70.8,9.21 75.25,7.94 79.38,8.89
  pour Bottom: 66.04,2.54 65.41,3.17 65.41,8.26 67.31,10.16 69.22,10.16 71.75,12.7 79.38,12.7 81.28,10.79 81.28,10.16 73.66,2.54
  pour Top (isolate 0.254, rank 3): 79.38,11.75 80.96,10.16 80.96,9.84 73.66,2.54 65.72,2.54 65.09,3.17 65.09,7.94 68.58,11.43 68.9,11.75
POWER
  Top 0.61: 60.96,43.18 53.34,43.18 52.39,44.13 5V_REG.1
  Top 1.016: IC2.6 59.69,14.61 C10.+
  Top 1.676: IC2.6 73.03,14.61 74.3,13.33 80.64,13.33 81.92,14.61 81.92,17.78 76.83,22.86 POWER.2 71.28,27.98 D1.C 70.28,28.78 68.26,30.8 68.26,36.03 IC1.6 64.14,40 60.96,43.18 | C15.+ 48.26,40 52.39,44.13
  Bottom 0.406: C13.2 48.26,45.4 5V_REG.1
  pour Top (rank 4): 45.09,32.07 45.09,40.64 46.99,42.54 46.99,50.8 53.98,50.8 57.78,46.99 73.66,29.85 60.96,22.86 60.96,30.48 59.69,38.73 56.2,35.24 56.2,33.97 54.61,32.38 54.61,32.07 53.66,31.12 46.04,31.12
  pour Top (isolate 0.254, rank 2): 54.61,19.69 54.61,15.88 54.61,13.33 57.78,10.16 81.92,10.16 82.55,10.79 82.55,26.67 79.38,29.85 67.31,29.85 59.69,22.23 57.15,22.23
PWM_A  (via drill 0.6)
  Top 0.406: v57.15,26.67 57.15,32.07 58.1,33.02 59.37,33.02 60.64,34.29 60.64,36.2 60.33,36.51 58.74,36.51 v57.78,37.46
  Bottom 0.406: v57.15,26.67 56.52,26.04 IC3.3 | 59.37,41.54 IC1.5 57.78,40.28 v57.78,37.46
PWM_B  (via drill 0.6)
  Top 0.406: v60.01,23.18 v56.83,23.18
  Bottom 0.406: IC2.5 62.18,17.15 61.91,17.15 60.33,18.73 60.33,22.86 v60.01,23.18 | v56.83,23.18 56.52,23.5 IC3.5
PWM_INV_A
  Bottom 0.406: IC3.2 53.02,27.31 52.07,28.26 52.07,30.8 51.12,31.75 34.61,31.75 33.97,32.38 33.97,34.19 R4.2 OK5.6
PWM_INV_B  (via drill 0.6)
  Top 0.406: OK2.6 29.21,41.91 | 29.21,41.91 R6.1 | v37.47,29.85 34.92,27.31 32.07,27.31 31.43,27.94 29.84,27.94 29.21,28.58 29.21,29.53 28.26,30.48 26.04,30.48 25.4,31.12 25.4,37.46 26.04,38.1 28.57,38.1 29.21,38.73 29.21,41.91
  Bottom 0.406: v37.47,29.85 37.47,30.48 38.1,31.12 50.8,31.12 51.44,30.48 51.44,27.94 54.61,24.77 IC3.4
R_BOOST_BRAKE
  Top 0.406: R23.2 24.13,26.67 24.13,27.94 OK5.1
R_BOOST_CLK
  Bottom 0.406: OK3.1 31.75,17.15 R25.2
R_BOOST_CS
  Bottom 0.406: OK1.4 29.84,18.42 26.67,21.59 24.45,21.59 23.18,20.32 23.18,19.47 R24.2
R_BOOST_DIN
  Bottom 0.406: OK3.4 R26.2
R_BOOST_DIR_A
  Bottom 0.406: R22.1 29.84,24.77 31.11,26.04 OK1.1
R_BOOST_DIR_B
  Bottom 0.406: OK2.1 20.32,46.99 R19.2
R_BOOST_PWM_A
  Top 0.406: R21.2 26.45,27.94 25.72,27.94 24.77,28.89 24.77,35.88 23.81,36.83 OK5.4
R_BOOST_PWM_B
  Bottom 0.406: OK2.4 19.37,39.37 19.68,39.69 20.74,39.69 R20.2
R_DOUT_BOOST_INV
  Bottom 0.406: OK4.4 27.94,36.83 29.21,35.56 29.21,31.12 29.84,30.48 35.24,30.48 37.47,28.26 R27.1
R_TEMP_BOOST_INV
  Bottom 0.406: OK4.1 27.62,28.26 R28.1
SENSE_A  (via drill 0.6)
  Top 0.406: v54.61,8.89 54.61,19.05 55.88,20.32 55.88,24.77 56.52,25.4 57.47,25.4 58.42,26.35 58.42,28.26 61.28,31.12 61.28,32.7 v60.96,33.02
  Bottom 0.406: R2.1 58.73,9.85 57.15,11.43 ADC_MPC3002.3 54.61,11.43 53.98,10.79 53.98,9.53 v54.61,8.89 | v60.96,33.02 60.96,33.27 IC1.8
SENSE_B
  Bottom 0.406: ADC_MPC3002.2 57.78,12.7 58.42,12.06 59.38,12.06 R1.1 60.01,11.75 60.33,11.43 67.88,11.43 IC2.8
TEMP  (via drill 0.6)
  Top 0.406: IC2.9 63.02,9.04 60.96,6.98 55.24,6.98 52.39,9.84 R18.1 52.07,14.61 50.16,16.51 50.16,18.73 51.75,20.32 52.7,20.32 53.34,19.69 54.29,19.69 54.93,20.32 54.93,21.91 54.61,22.23 v53.98,22.23 53.98,22.86 54.93,23.81 54.93,25.4 55.88,26.35 55.88,32.07 58.74,34.92 59.19,34.92 IC1.9
  Bottom 0.406: v53.98,22.23 IC3.6
TEMP_BOOST_INV  (via drill 0.6)
  Top 0.406: v46.04,20.96 v53.66,20.96
  Bottom 0.406: R28.2 30.48,27.62 33.02,27.62 36.2,24.45 36.2,23.18 39.69,19.69 42.55,19.69 42.86,19.37 44.77,19.37 45.09,19.69 45.09,20 v46.04,20.96 | v53.66,20.96 IC3.7
TEMP_LOG  (via drill 0.6)
  Top 0.406: OK4.7 R9.2 14.82,31.96 16.19,33.34 16.19,42.86 16.51,43.18 v16.83,43.18
  Bottom 0.406: SV1.3 13.97,50.16 12.38,48.58 10.48,48.58 10.16,48.26 10.16,46.99 11.11,46.04 13.97,46.04 v16.83,43.18

### Text on the board
bPlace: 1 | 1
tNames: MOTA_1 | MOTA_2 | - | + | MOTB_2 | MOTB_1
bNames: Victor Dubois / Carte moteur 2018-2019